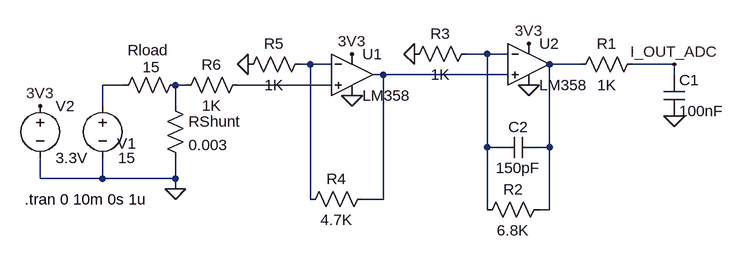
[diagram p0: schematic I_OUT_ADC.asc]
I_OUT_ADC.asc, the LTspice schematic file:
Version 4
SHEET 1 880 680
WIRE 352 208 320 208
WIRE 384 208 352 208
WIRE 80 224 64 224
WIRE 112 224 80 224
WIRE 496 224 448 224
WIRE 640 224 576 224
WIRE 192 240 176 240
WIRE 384 240 192 240
WIRE 640 240 640 224
WIRE -208 256 -240 256
WIRE -112 256 -128 256
WIRE 112 256 -32 256
WIRE -240 288 -240 256
WIRE -128 288 -128 256
WIRE 352 352 352 208
WIRE 368 352 352 352
WIRE 448 352 448 224
WIRE 448 352 432 352
WIRE -336 400 -336 368
WIRE -240 400 -240 368
WIRE -240 400 -336 400
WIRE -128 400 -128 368
WIRE -128 400 -240 400
WIRE -128 416 -128 400
WIRE 80 432 80 224
WIRE 192 432 192 240
WIRE 192 432 160 432
WIRE 352 448 352 352
WIRE 448 448 448 352
WIRE 448 448 432 448
FLAG -336 288 3V3
FLAG 144 208 3V3
FLAG 416 192 3V3
FLAG -128 416 0
FLAG 144 272 0
FLAG 416 256 0
FLAG 640 304 0
FLAG 240 208 0
FLAG -16 224 0
FLAG 640 224 I_OUT_ADC
SYMBOL ZZZ\\OpAmp\\LM358 144 240 R0
SYMATTR InstName U1
SYMBOL ZZZ\\OpAmp\\LM358 416 224 R0
SYMATTR InstName U2
SYMBOL cap 624 240 R0
SYMATTR InstName C1
SYMATTR Value 100nF
SYMBOL cap 368 368 R270
WINDOW 0 32 32 VTop 2
WINDOW 3 0 32 VBottom 2
SYMATTR InstName C2
SYMATTR Value 150pF
SYMBOL res 592 208 R90
WINDOW 0 0 56 VBottom 2
WINDOW 3 32 56 VTop 2
SYMATTR InstName R1
SYMATTR Value 1K
SYMBOL res 448 432 R90
WINDOW 0 0 56 VBottom 2
WINDOW 3 32 56 VTop 2
SYMATTR InstName R2
SYMATTR Value 6.8K
SYMBOL res 336 192 R90
WINDOW 0 0 56 VBottom 2
WINDOW 3 32 56 VTop 2
SYMATTR InstName R3
SYMATTR Value 1K
SYMBOL res 176 416 R90
WINDOW 0 0 56 VBottom 2
WINDOW 3 32 56 VTop 2
SYMATTR InstName R4
SYMATTR Value 4.7K
SYMBOL res 80 208 R90
WINDOW 0 0 56 VBottom 2
WINDOW 3 32 56 VTop 2
SYMATTR InstName R5
SYMATTR Value 1K
SYMBOL res -16 240 R90
WINDOW 0 0 56 VBottom 2
WINDOW 3 32 56 VTop 2
SYMATTR InstName R6
SYMATTR Value 1K
SYMBOL res -144 272 R0
SYMATTR InstName RShunt
SYMATTR Value 0.003
SYMBOL voltage -240 272 R0
WINDOW 0 22 74 Left 2
WINDOW 123 0 0 Left 0
WINDOW 39 0 0 Left 0
SYMATTR InstName V1
SYMATTR Value 15
SYMBOL voltage -336 272 R0
WINDOW 123 0 0 Left 0
WINDOW 39 0 0 Left 0
SYMATTR InstName V2
SYMATTR Value 3.3V
SYMBOL res -112 240 R90
WINDOW 0 -22 58 VBottom 2
WINDOW 3 -27 53 VTop 2
SYMATTR InstName Rload
SYMATTR Value 15
TEXT -360 432 Left 2 !.tran 0 10m 0s 1u

The netlist it stands for:
* I_OUT_ADC.asc
XU1 N007 N002 3V3 0 N004 LM358  ; pins In+ In- V+ V- OUT
XU2 N004 N001 3V3 0 N003 LM358  ; pins In+ In- V+ V- OUT
C1 I_OUT_ADC 0 100nF
C2 N001 N003 150pF
R1 I_OUT_ADC N003 1K
R2 N003 N001 6.8K
R3 N001 0 1K
R4 N004 N002 4.7K
R5 N002 0 1K
R6 N007 N006 1K
RShunt N006 0 0.003
V1 N005 0 15
V2 3V3 0 3.3V
Rload N006 N005 15
.tran 0 10m 0s 1u
.backanno
.end